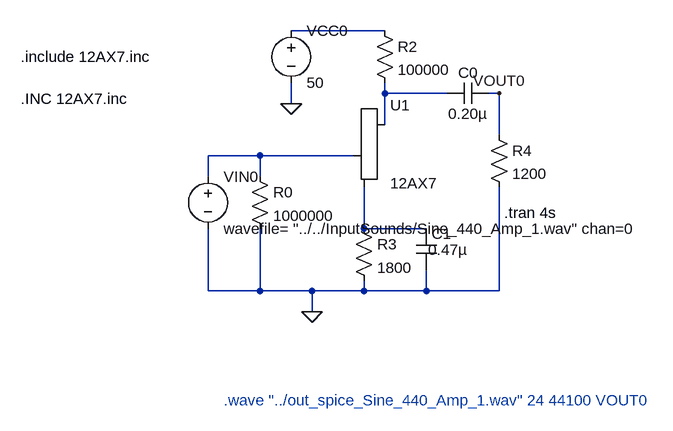
[diagram p0: schematic CommonCathodeAmplifier.asc]
CommonCathodeAmplifier.asc, the LTspice schematic file:
Version 4
SHEET 1 1284 696
WIRE -128 112 -272 112
WIRE -128 208 -128 192
WIRE -32 208 -128 208
WIRE 48 208 32 208
WIRE -272 224 -272 192
WIRE -128 256 -128 208
WIRE 48 272 48 208
WIRE -320 304 -400 304
WIRE -176 304 -320 304
WIRE -400 336 -400 304
WIRE -320 336 -320 304
WIRE -160 416 -160 352
WIRE -64 416 -160 416
WIRE -400 512 -400 416
WIRE -320 512 -320 416
WIRE -320 512 -400 512
WIRE -240 512 -320 512
WIRE -160 512 -160 496
WIRE -160 512 -240 512
WIRE -64 512 -64 480
WIRE -64 512 -160 512
WIRE 48 512 48 352
WIRE 48 512 -64 512
WIRE -240 544 -240 512
FLAG -272 224 0
FLAG -240 544 0
FLAG 48 208 VOUT0
SYMBOL /Misc/triode -128 304 R0
SYMATTR InstName U1
SYMATTR Value 12AX7
SYMATTR SpiceModel 12AX7
SYMBOL /res -336 320 R0
SYMATTR InstName R0
SYMATTR Value 1000000
SYMBOL /res -144 96 R0
SYMATTR InstName R2
SYMATTR Value 100000
SYMBOL /res -176 400 R0
SYMATTR InstName R3
SYMATTR Value 1800
SYMBOL /cap -80 416 R0
WINDOW 3 19 33 Left 2
SYMATTR Value 0.47µ
SYMATTR InstName C1
SYMBOL /voltage -272 96 R0
SYMATTR InstName VCC0
SYMATTR Value 50
SYMBOL /voltage -400 320 R0
SYMATTR InstName VIN0
SYMATTR Value wavefile= "../../InputSounds/Sine_440_Amp_1.wav" chan=0
SYMBOL res 32 256 R0
SYMATTR InstName R4
SYMATTR Value 1200
SYMBOL cap -32 224 R270
WINDOW 0 32 32 VTop 2
WINDOW 3 0 32 VBottom 2
SYMATTR InstName C0
SYMATTR Value 0.20µ
TEXT -688 152 Left 2 !.include 12AX7.inc
TEXT -688 216 Left 2 !.INC 12AX7.inc
TEXT 56 392 Left 2 !.tran 4s
TEXT -376 680 Left 2 ;.wave "../out_spice_Sine_440_Amp_1.wav" 24 44100 VOUT0

The netlist it stands for:
* CommonCathodeAmplifier.asc
XU1 N002 N003 N004 12AX7 12AX7
R0 N003 0 1000000
R2 N001 N002 100000
R3 N004 0 1800
C1 N004 0 0.47µ
VCC0 N001 0 50
VIN0 N003 0 wavefile= "../../InputSounds/Sine_440_Amp_1.wav" chan=0
R4 VOUT0 0 1200
C0 N002 VOUT0 0.20µ
.include 12AX7.inc
.INC 12AX7.inc
.tran 4s
* .wave "../out_spice_Sine_440_Amp_1.wav" 24 44100 VOUT0
.backanno
.end